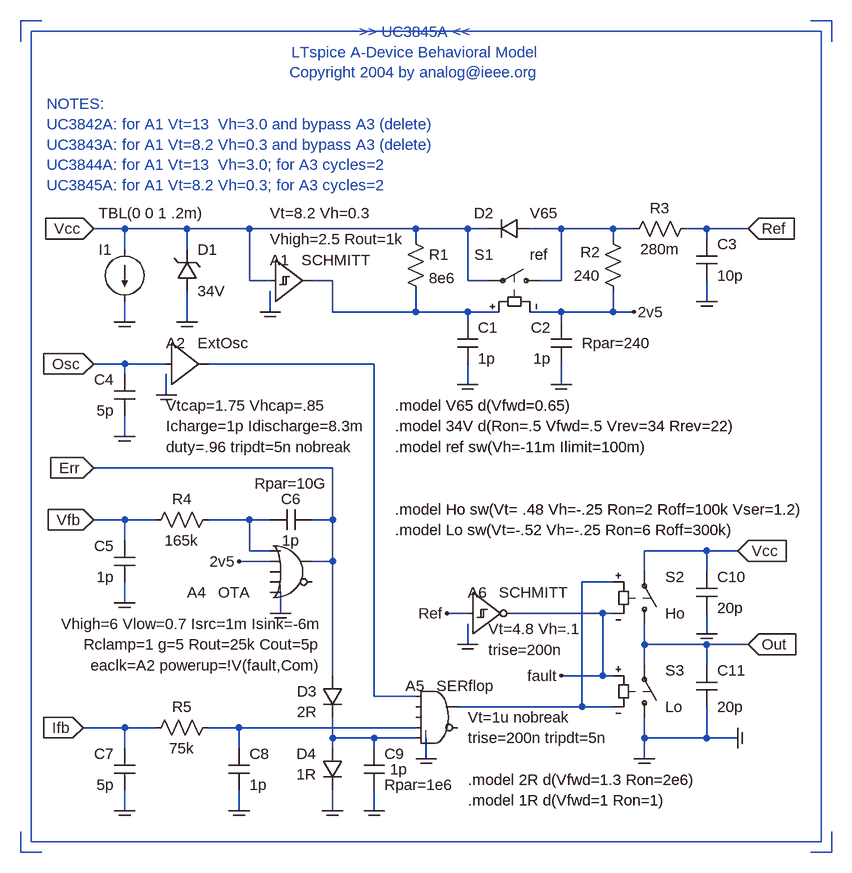
[diagram p0: schematic LT3843A.asc]
LT3843A.asc, the LTspice schematic file:
Version 4
SHEET 1 1688 948
WIRE -464 -544 -464 -576
WIRE -464 704 -464 672
WIRE -432 -576 -464 -576
WIRE -432 704 -464 704
WIRE -304 -256 -352 -256
WIRE -304 -224 -304 -256
WIRE -304 -112 -304 -144
WIRE -304 -48 -352 -48
WIRE -304 -32 -304 -48
WIRE -304 64 -304 32
WIRE -304 192 -352 192
WIRE -304 224 -304 192
WIRE -304 320 -304 288
WIRE -304 512 -368 512
WIRE -304 544 -304 512
WIRE -304 640 -304 608
WIRE -256 192 -304 192
WIRE -256 512 -304 512
WIRE -240 -48 -304 -48
WIRE -240 0 -240 -32
WIRE -208 -256 -304 -256
WIRE -208 -224 -208 -256
WIRE -208 -112 -208 -160
WIRE -128 512 -176 512
WIRE -128 544 -128 512
WIRE -128 640 -128 608
WIRE -112 -256 -208 -256
WIRE -112 -176 -112 -256
WIRE -112 192 -176 192
WIRE -112 240 -112 192
WIRE -80 -176 -112 -176
WIRE -80 -128 -80 -160
WIRE -80 192 -112 192
WIRE -80 240 -112 240
WIRE -80 256 -128 256
WIRE -64 336 -64 304
WIRE 16 -176 -16 -176
WIRE 16 -128 16 -176
WIRE 16 112 -352 112
WIRE 16 192 -16 192
WIRE 16 192 16 112
WIRE 16 256 -16 256
WIRE 16 256 16 192
WIRE 16 432 16 256
WIRE 16 528 16 496
WIRE 16 544 16 528
WIRE 16 640 16 608
WIRE 80 -48 -176 -48
WIRE 80 464 80 -48
WIRE 80 528 16 528
WIRE 80 544 80 528
WIRE 80 640 80 608
WIRE 144 -256 -112 -256
WIRE 144 -240 144 -256
WIRE 144 -128 16 -128
WIRE 144 -128 144 -160
WIRE 144 464 80 464
WIRE 144 512 -128 512
WIRE 144 528 80 528
WIRE 160 560 160 528
WIRE 224 -256 144 -256
WIRE 224 -176 224 -256
WIRE 224 -128 144 -128
WIRE 224 -112 224 -128
WIRE 224 -16 224 -48
WIRE 224 336 192 336
WIRE 224 384 224 352
WIRE 256 -256 224 -256
WIRE 256 -176 224 -176
WIRE 272 -128 224 -128
WIRE 368 -256 320 -256
WIRE 368 -176 336 -176
WIRE 368 -176 368 -256
WIRE 368 -128 320 -128
WIRE 368 -112 368 -128
WIRE 368 -16 368 -48
WIRE 400 480 208 480
WIRE 400 480 400 288
WIRE 432 336 288 336
WIRE 432 432 368 432
WIRE 432 432 432 336
WIRE 448 -256 368 -256
WIRE 448 -240 448 -256
WIRE 448 -128 368 -128
WIRE 448 -128 448 -160
WIRE 448 288 400 288
WIRE 448 336 432 336
WIRE 448 432 432 432
WIRE 448 480 400 480
WIRE 480 -256 448 -256
WIRE 480 -128 448 -128
WIRE 496 272 496 240
WIRE 496 384 496 352
WIRE 496 416 496 384
WIRE 496 528 496 496
WIRE 496 560 496 528
WIRE 592 -256 560 -256
WIRE 592 -240 592 -256
WIRE 592 -144 592 -176
WIRE 592 240 496 240
WIRE 592 272 592 240
WIRE 592 368 592 336
WIRE 592 384 496 384
WIRE 592 416 592 384
WIRE 592 528 496 528
WIRE 592 528 592 480
WIRE 640 240 592 240
WIRE 640 528 592 528
WIRE 656 -256 592 -256
WIRE 656 384 592 384
WIRE 784 -576 752 -576
WIRE 784 -544 784 -576
WIRE 784 704 752 704
WIRE 784 704 784 672
FLAG 656 384 Out
IOPIN 656 384 In
FLAG 592 -144 COM
FLAG 656 -256 Ref
IOPIN 656 -256 In
FLAG -352 -48 Osc
IOPIN -352 -48 In
FLAG -128 640 COM
FLAG -352 192 Vfb
IOPIN -352 192 In
FLAG -352 112 Err
IOPIN -352 112 In
FLAG 16 640 COM
FLAG -368 512 Ifb
IOPIN -368 512 In
FLAG -304 640 COM
FLAG -304 320 COM
FLAG -304 64 COM
FLAG -128 256 2v5
FLAG -352 -256 Vcc
IOPIN -352 -256 In
FLAG 368 -16 COM
FLAG 640 240 Vcc
IOPIN 640 240 In
FLAG 640 528 Com
IOPIN 640 528 In
FLAG 592 368 COM
FLAG 480 -128 2v5
FLAG 192 336 Ref
FLAG 80 640 COM
FLAG -208 -112 COM
FLAG 224 -16 COM
FLAG 368 432 fault
FLAG -304 -112 COM
FLAG 224 384 COM
FLAG -64 336 COM
FLAG 160 560 COM
FLAG -240 0 COM
FLAG -80 -128 COM
FLAG 496 560 COM
SYMBOL current -304 -224 R0
WINDOW 3 -40 -56 Left 0
WINDOW 123 0 0 Left 0
WINDOW 39 0 0 Left 0
WINDOW 0 -40 0 Left 0
SYMATTR Value TBL(0 0 1 .2m)
SYMATTR InstName I1
SYMBOL zener -224 -160 M180
WINDOW 0 32 64 Left 0
WINDOW 3 32 0 Left 0
SYMATTR InstName D1
SYMATTR Value 34V
SYMBOL Digital\\schmtbuf -80 -240 R0
WINDOW 0 0 32 Left 0
WINDOW 3 0 -40 Left 0
WINDOW 38 48 32 Left 0
WINDOW 123 0 0 Left 0
SYMATTR InstName A1
SYMATTR Value Vt=8.2 Vh=0.3
SYMATTR Value2 Vhigh=2.5 Rout=1k
SYMBOL res 128 -256 R0
SYMATTR InstName R1
SYMATTR Value 8e6
SYMBOL cap 208 -112 R0
WINDOW 0 32 8 Left 0
WINDOW 3 32 56 Left 0
SYMATTR InstName C1
SYMATTR Value 1p
SYMBOL sw 352 -176 M270
WINDOW 0 40 88 VRight 0
WINDOW 3 40 32 VLeft 0
SYMATTR InstName S1
SYMATTR Value ref
SYMBOL diode 320 -272 R90
WINDOW 0 -8 56 VRight 0
WINDOW 3 -8 0 VLeft 0
SYMATTR InstName D2
SYMATTR Value V65
SYMBOL cap 384 -112 M0
WINDOW 3 32 56 Left 0
WINDOW 39 -16 32 Right 0
WINDOW 0 32 8 Left 0
SYMATTR Value 1p
SYMATTR SpiceLine Rpar=240
SYMATTR InstName C2
SYMBOL res 464 -144 R180
WINDOW 0 36 76 Left 0
WINDOW 3 36 40 Left 0
SYMATTR InstName R2
SYMATTR Value 240
SYMBOL res 576 -272 R90
WINDOW 0 0 56 VBottom 0
WINDOW 3 32 56 VTop 0
SYMATTR InstName R3
SYMATTR Value 280m
SYMBOL cap 576 -176 M180
WINDOW 0 32 56 Left 0
WINDOW 3 32 8 Left 0
SYMATTR InstName C3
SYMATTR Value 10p
SYMBOL cap -288 -32 M0
WINDOW 3 32 56 Left 0
WINDOW 0 32 8 Left 0
SYMATTR Value 5p
SYMATTR InstName C4
SYMBOL Digital\\buf1 -240 -112 R0
WINDOW 3 0 128 Left 0
WINDOW 38 48 32 Left 0
WINDOW 0 0 32 Left 0
WINDOW 123 0 160 Left 0
WINDOW 39 0 192 Left 0
SYMATTR Value Vtcap=1.75 Vhcap=.85
SYMATTR SpiceModel ExtOsc
SYMATTR InstName A2
SYMATTR Value2 Icharge=1p Idischarge=8.3m
SYMATTR SpiceLine duty=.96 tripdt=5n nobreak
SYMBOL cap -288 224 M0
WINDOW 0 32 8 Left 0
WINDOW 3 32 56 Left 0
SYMATTR InstName C5
SYMATTR Value 1p
SYMBOL res -160 176 R90
WINDOW 0 0 56 VBottom 0
WINDOW 3 32 56 VTop 0
SYMATTR InstName R4
SYMATTR Value 165k
SYMBOL cap -16 176 R90
WINDOW 0 0 32 VBottom 0
WINDOW 3 32 32 VTop 0
WINDOW 39 -40 32 VCenter 0
SYMATTR InstName C6
SYMATTR Value 1p
SYMATTR SpiceLine Rpar=10G
SYMBOL Digital\\or -48 208 R0
WINDOW 0 -160 96 Left 0
WINDOW 38 -112 96 Left 0
WINDOW 3 48 144 Right 0
WINDOW 123 48 176 Right 0
WINDOW 39 48 208 Right 0
SYMATTR InstName A4
SYMATTR SpiceModel OTA
SYMATTR Value Vhigh=6 Vlow=0.7 Isrc=1m Isink=-6m
SYMATTR Value2 Rclamp=1 g=5 Rout=25k Cout=5p
SYMATTR SpiceLine eaclk=A2 powerup=!V(fault,Com)
SYMBOL cap -288 544 M0
WINDOW 0 32 8 Left 0
WINDOW 3 32 56 Left 0
SYMATTR InstName C7
SYMATTR Value 5p
SYMBOL res -160 496 R90
WINDOW 0 0 56 VBottom 0
WINDOW 3 32 56 VTop 0
SYMATTR InstName R5
SYMATTR Value 75k
SYMBOL cap -144 544 R0
WINDOW 0 32 8 Left 0
WINDOW 3 32 56 Left 0
SYMATTR InstName C8
SYMATTR Value 1p
SYMBOL diode 32 432 M0
WINDOW 3 40 56 Left 0
WINDOW 0 40 24 Left 0
SYMATTR Value 2R
SYMATTR InstName D3
SYMBOL diode 32 544 M0
WINDOW 3 41 40 Left 0
WINDOW 0 41 8 Left 0
SYMATTR Value 1R
SYMATTR InstName D4
SYMBOL cap 64 544 R0
WINDOW 0 32 8 Left 0
WINDOW 3 40 32 Left 0
WINDOW 39 32 56 Left 0
SYMATTR InstName C9
SYMATTR Value 1p
SYMATTR SpiceLine Rpar=1e6
SYMBOL Digital\\and 176 432 R0
WINDOW 0 -48 16 Left 0
WINDOW 38 0 16 Left 0
WINDOW 3 48 64 Left 0
WINDOW 123 48 96 Left 0
SYMATTR InstName A5
SYMATTR SpiceModel SERflop
SYMATTR Value Vt=1u nobreak
SYMATTR Value2 trise=200n tripdt=5n
SYMBOL Digital\\schmtinv 224 272 R0
WINDOW 0 0 32 Left 0
WINDOW 3 32 88 Left 0
WINDOW 38 48 32 Left 0
WINDOW 123 32 120 Left 0
SYMATTR InstName A6
SYMATTR Value Vt=4.8 Vh=.1
SYMATTR Value2 trise=200n
SYMBOL sw 496 368 M180
WINDOW 0 32 88 Left 0
WINDOW 3 32 32 Left 0
SYMATTR InstName S2
SYMATTR Value Ho
SYMBOL sw 496 512 M180
WINDOW 0 32 88 Left 0
WINDOW 3 32 32 Left 0
SYMATTR InstName S3
SYMATTR Value Lo
SYMBOL cap 576 272 R0
WINDOW 3 32 56 Left 0
WINDOW 0 32 8 Left 0
SYMATTR Value 20p
SYMATTR InstName C10
SYMBOL cap 576 416 R0
WINDOW 0 32 8 Left 0
WINDOW 3 32 64 Left 0
SYMATTR InstName C11
SYMATTR Value 20p
TEXT 224 624 Left 0 !.model 1R d(Vfwd=1 Ron=1)
TEXT 224 592 Left 0 !.model 2R d(Vfwd=1.3 Ron=2e6)
TEXT 112 48 Left 0 !.model 34V d(Ron=.5 Vfwd=.5 Vrev=34 Rrev=22)
TEXT 112 80 Left 0 !.model ref sw(Vh=-11m Ilimit=100m)
TEXT 112 176 Left 0 !.model Ho sw(Vt= .48 Vh=-.25 Ron=2 Roff=100k Vser=1.2)
TEXT 112 208 Left 0 !.model Lo sw(Vt=-.52 Vh=-.25 Ron=6 Roff=300k)
TEXT 112 16 Left 0 !.model V65 d(Vfwd=0.65)
TEXT 144 -528 Center 0 ;>> UC3845A <<\nLTspice A-Device Behavioral Model\nCopyright 2004 by analog@ieee.org
TEXT -424 -448 Left 0 ;NOTES:\nUC3842A: for A1 Vt=13  Vh=3.0 and bypass A3 (delete)\nUC3843A: for A1 Vt=8.2 Vh=0.3 and bypass A3 (delete)\nUC3844A: for A1 Vt=13  Vh=3.0; for A3 cycles=2\nUC3845A: for A1 Vt=8.2 Vh=0.3; for A3 cycles=2
RECTANGLE Normal 768 688 -448 -560

The netlist it stands for:
* LT3843A.asc
I1 Vcc COM TBL(0 0 1 .2m)
D1 COM Vcc 34V
A1 Vcc COM COM COM COM COM N005 COM SCHMITT Vt=8.2 Vh=0.3 Vhigh=2.5 Rout=1k
R1 Vcc N005 8e6
C1 N005 COM 1p
S1 N008 Vcc N005 2v5 ref
D2 N008 Vcc V65
C2 2v5 COM 1p Rpar=240
R2 2v5 N008 240
R3 Ref N008 280m
C3 COM Ref 10p
C4 Osc COM 5p
A2 Osc COM COM COM COM COM N007 COM ExtOsc Vtcap=1.75 Vhcap=.85 Icharge=1p Idischarge=8.3m duty=.96 tripdt=5n nobreak
C5 Vfb COM 1p
R4 N004 Vfb 165k
C6 Err N004 1p Rpar=10G
A4 N004 2v5 COM COM COM COM Err COM OTA Vhigh=6 Vlow=0.7 Isrc=1m Isink=-6m Rclamp=1 g=5 Rout=25k Cout=5p eaclk=A2 powerup=!V(fault,Com)
C7 Ifb COM 5p
R5 N003 Ifb 75k
C8 N003 COM 1p
D3 Err N006 2R
D4 N006 COM 1R
C9 N006 COM 1p Rpar=1e6
A5 N007 COM COM N003 N006 COM N009 COM SERflop Vt=1u nobreak trise=200n tripdt=5n
A6 Ref COM COM COM COM fault COM COM SCHMITT Vt=4.8 Vh=.1 trise=200n
S2 Out Vcc N009 fault Ho
S3 COM Out fault N009 Lo
C10 Vcc COM 20p
C11 Out COM 20p
.model D D
.lib standard.dio
.model 1R d(Vfwd=1 Ron=1)
.model 2R d(Vfwd=1.3 Ron=2e6)
.model 34V d(Ron=.5 Vfwd=.5 Vrev=34 Rrev=22)
.model ref sw(Vh=-11m Ilimit=100m)
.model Ho sw(Vt= .48 Vh=-.25 Ron=2 Roff=100k Vser=1.2)
.model Lo sw(Vt=-.52 Vh=-.25 Ron=6 Roff=300k)
.model V65 d(Vfwd=0.65)
* >> UC3845A <<
* LTspice A-Device Behavioral Model
* Copyright 2004 by analog@ieee.org
* NOTES:
* UC3842A: for A1 Vt=13  Vh=3.0 and bypass A3 (delete)
* UC3843A: for A1 Vt=8.2 Vh=0.3 and bypass A3 (delete)
* UC3844A: for A1 Vt=13  Vh=3.0; for A3 cycles=2
* UC3845A: for A1 Vt=8.2 Vh=0.3; for A3 cycles=2
.backanno
.end